# Altium schematic sheet TK522_LV-Trafo.SchDoc: TK517 P5V0-PSU
size A3; Organization: Omega Verksted; DocumentNumber: 10; Revision: 0; SheetNumber: 10; SheetTotal: 20
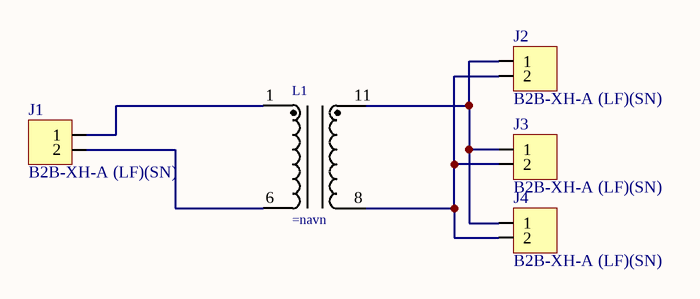
[diagram p0: TK522_LV-Trafo.SchDoc]

## Parts
J1  B2B-XH-A (LF)(SN)  [JST_2P]
J2  B2B-XH-A (LF)(SN)  [JST_2P]
J3  B2B-XH-A (LF)(SN)  [JST_2P]
J4  B2B-XH-A (LF)(SN)  [JST_2P]
L1  (no value)  [44268 MYRRA TRANSFORMER]

## Nets
NetJ1_1: J1.1 L1.1
NetJ1_2: J1.2 L1.6
NetJ2_1: J2.1 J3.1 J4.1 L1.11
NetJ2_2: J2.2 J3.2 J4.2 L1.8

## Notes on the sheet
- Size:
- Date:
- Title:
- A3
- Revision:
- Sheet
- of
- Author:
- File:

## Library data of the parts
J1-J4 = 2227: id: 2227; rad: 1; rom: GM; lager_type: Baklager; dybde: 2; hylle: 0; antall: 170; pakke_opprettet_av: 815; beskrivelse: JST 2pin (pris pr. stk.); leverandor_varenr: 1516276; nokkelord: Connector, Kontakt; produsent: JST; leverandor: Farnell; pakketype: TH; kolonne: 0; pakke_opprettet: 28.06.2014 18:25:03; symbol_opprettet_av: 815; symbol_opprettet: 28.06.2014 15:33:17; navn: B2B-XH-A (LF)(SN); pris: 2
L1 = 44268 Myrra Transformer: farnell: 1689089